# Altium schematic sheet timer_power.SchDoc
size A3; DocumentNumber: 2; SheetNumber: 2; SheetTotal: 3
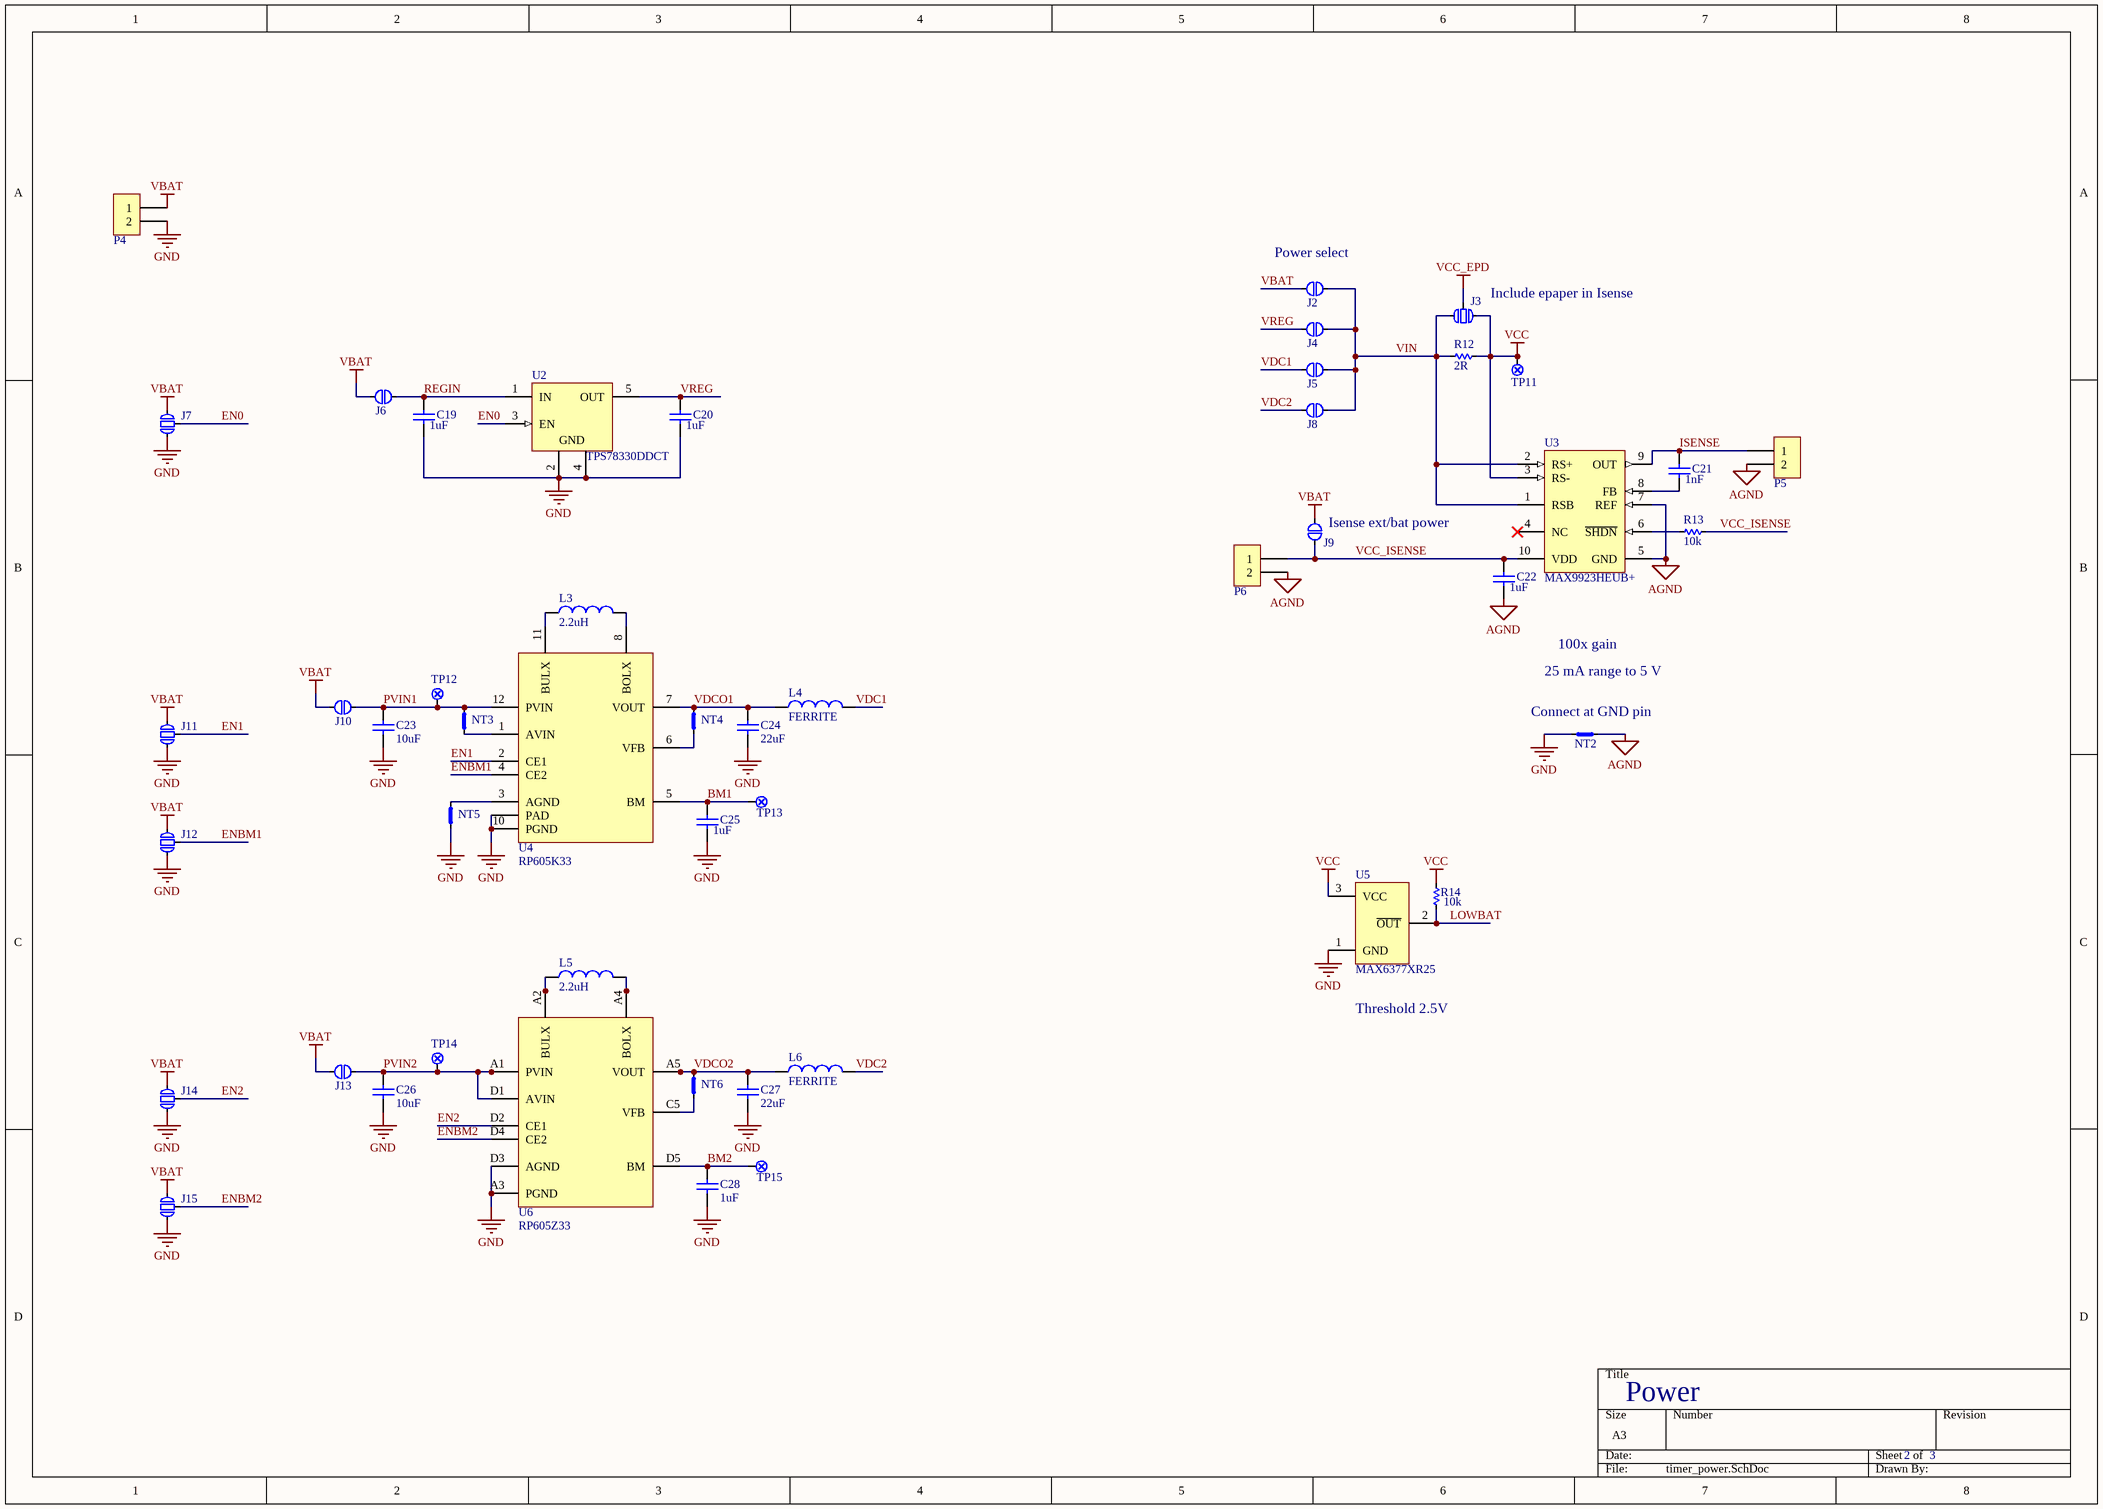
[diagram p0: timer_power.SchDoc]

## Parts
C19  value 1uF  [C0603/1608]  (hidden comment: CAP)
C20  value 1uF  [C0603/1608]  (hidden comment: CAP)
C21  value 1nF  [C0603/1608]  (hidden comment: CAP)
C22  value 1uF  [C0603/1608]  (hidden comment: CAP)
C23  value 10uF  [C0805/2012]  (hidden comment: CAP)
C24  value 22uF  [C0805/2012]  (hidden comment: CAP)
C25  value 1uF  [C0603/1608]  (hidden comment: CAP)
C26  value 10uF  [C0805/2012]  (hidden comment: CAP)
C27  value 22uF  [C0805/2012]  (hidden comment: CAP)
C28  value 1uF  [C0603/1608]  (hidden comment: CAP)
J2  SEL2  [JMP2]  (value not drawn)  (no BOM)
J3  SEL3  [JMP3]  (value not drawn)  (no BOM)
J4  SEL2  [JMP2]  (value not drawn)  (no BOM)
J5  SEL2  [JMP2]  (value not drawn)  (no BOM)
J6  SEL2  [JMP2]  (value not drawn)  (no BOM)
J7  SEL3  [JMP3]  (value not drawn)  (no BOM)
J8  SEL2  [JMP2]  (value not drawn)  (no BOM)
J9  SEL2  [JMP2]  (value not drawn)  (no BOM)
J10  SEL2  [JMP2]  (value not drawn)  (no BOM)
J11  SEL3  [JMP3]  (value not drawn)  (no BOM)
J12  SEL3  [JMP3]  (value not drawn)  (no BOM)
J13  SEL2  [JMP2]  (value not drawn)  (no BOM)
J14  SEL3  [JMP3]  (value not drawn)  (no BOM)
J15  SEL3  [JMP3]  (value not drawn)  (no BOM)
L3  value 2.2uH  [IND3x3mm]  (hidden comment: IND)
L4  value FERRITE  [R0603/1608]  (hidden comment: IND)
L5  value 2.2uH  [IND3x3mm]  (hidden comment: IND)
L6  value FERRITE  [R0603/1608]  (hidden comment: IND)
NT2  NET_TIE  [NT2_0.5mm]  (value not drawn)  (net tie, no BOM)
NT3  NET_TIE  [NT2_0.5mm]  (value not drawn)  (net tie, no BOM)
NT4  NET_TIE  [NT2_0.5mm]  (value not drawn)  (net tie, no BOM)
NT5  NET_TIE  [NT2_0.5mm]  (value not drawn)  (net tie, no BOM)
NT6  NET_TIE  [NT2_0.5mm]  (value not drawn)  (net tie, no BOM)
P4  SIL2  [PINS-2]  (value not drawn)
P5  SIL2  [PINS-2]  (value not drawn)
P6  SIL2  [PINS-2]  (value not drawn)
R12  value 2R  [R0805/2012]  (hidden comment: RES)
R13  value 10k  [R0603/1608]  (hidden comment: RES)
R14  value 10k  [R0603/1608]  (hidden comment: RES)
TP11  TP  [TP-1.0]  (value not drawn)  (no BOM)
TP12  TP  [TP-1.0]  (value not drawn)  (no BOM)
TP13  TP  [TP-1.0]  (value not drawn)  (no BOM)
TP14  TP  [TP-1.0]  (value not drawn)  (no BOM)
TP15  TP  [TP-1.0]  (value not drawn)  (no BOM)
U2  TPS78330DDCT  [DDC0005A_L]
U3  MAX9923HEUB+  [MAXM-U10+2_N]
U4  RP605K33  [DFN(PLP)2730-12]
U5  MAX6377XR25  [SC70-3]
U6  RP605Z33  [WLCSP-20-P3]

## Nets
AGND: C22.1 NT2.2 P5.2 P6.2 U3.5(GND) U3.7(REF)
GND: C19.1 C20.1 C23.1 C24.1 C25.1 C26.1 C27.1 C28.1 J7.1 J11.1 J12.1 J14.1 J15.1 NT2.1 NT5.1 P4.2 U2.2(GND) U2.4(GND) U4.0(PAD) U4.9(PGND) U4.10(PGND) U5.1(GND) U6.A3(PGND) U6.B3(PGND) U6.C3(PGND) U6.D3(AGND)
VBAT: J2.1 J6.1 J7.3 J9.2 J10.1 J11.3 J12.3 J13.1 J14.3 J15.3 P4.1
VCC: J3.1 R12.2 R14.1 TP11.0 U3.3(RS-) U5.3(VCC)
VCC_EPD: J3.2
BM1: C25.2 TP13.0 U4.5(BM)
BM2: C28.2 TP15.0 U6.D5(BM)
EN0: J7.2 U2.3(EN)
EN1: J11.2 U4.2(CE1)
EN2: J14.2 U6.D2(CE1)
ENBM1: J12.2 U4.4(CE2)
ENBM2: J15.2 U6.D4(CE2)
ISENSE: C21.2 P5.1 U3.9(OUT)
LOWBAT: R14.2 U5.2(~{OUT})
PVIN1: C23.2 J10.2 NT3.2 TP12.0 U4.12(PVIN)
PVIN2: C26.2 J13.2 TP14.0 U6.A1(PVIN) U6.B1(PVIN) U6.C1(PVIN) U6.D1(AVIN)
REGIN: C19.2 J6.2 U2.1(IN)
VCC_ISENSE: C22.2 J9.1 P6.1 R13.2 U3.10(VDD)
VDC1: J5.1 L4.2
VDC2: J8.1 L6.2
VDCO1: C24.2 L4.1 NT4.2 U4.7(VOUT)
VDCO2: C27.2 L6.1 NT6.2 U6.A5(VOUT) U6.B5(VOUT)
VIN: J2.2 J3.3 J4.2 J5.2 J8.2 R12.1 U3.1(RSB) U3.2(RS+)
VREG: C20.2 J4.1 U2.5(OUT)
NetC21_1: C21.1 U3.8(FB)
NetL3_1: L3.1 U4.11(BULX)
NetL3_2: L3.2 U4.8(BOLX)
NetL5_1: L5.1 U6.A2(BULX) U6.B2(BULX) U6.C2(BULX)
NetL5_2: L5.2 U6.A4(BOLX) U6.B4(BOLX) U6.C4(BOLX)
NetNT3_1: NT3.1 U4.1(AVIN)
NetNT4_1: NT4.1 U4.6(VFB)
NetNT5_2: NT5.2 U4.3(AGND)
NetNT6_1: NT6.1 U6.C5(VFB)
NetR13_1: R13.1 U3.6(~{SHDN})

Not connected (* = marked no-connect by the designer): U3 4(NC)*

## Notes on the sheet
- (near J2) Power select
- (near J3) Include epaper in Isense
- (near J9) Isense ext/bat power
- 100x gain
- (near NT2) Connect at GND pin
- 25 mA range to 5 V
- (near U5) Threshold 2.5V
- Power

## Library data of the parts
C19-C28 = CAP: Capacitor; Tolerance: x%; Voltage: 6.3V; Type: X5R/X7R
J2 J4-J6 J8-J10 J13 = SEL2: solderable jumper
J3 J7 J11 J12 J14 J15 = SEL3: solderable jumper
L3-L6 = IND: Inductor
NT2-NT6 = NET_TIE2: Link between nets
P4-P6 = SIL2: SIL package, 2 pins
R12-R14 = RES: Resistor; Tolerance: x%
TP11-TP15 = TP: Test point
U2 = CMP-0394-01077-2: Single Output LDO, 150 mA, Fixed 3 V Output, 2.2 to 5.5 V Input, with Ultra-Low IQ, 5-pin SOT (DDC), -40 to 105 degC, Green (RoHS & no Sb/Br); Manufacturer: Texas Instruments; Vout Adj(Min)(V): 3; SubFamily: Single Channel LDO; Iout(Max)(A): 0.15; Vdo(Typ)(mV): 130; Rating: Catalog; Iq(Typ)(mA): 0.0005; Vin(Min)(V): 2.2; Vin(Max)(V): 5.5; PackageDescription: 5-Pin Plastic Small Outline, Body 2.9 x 1.6 mm, 0.95 mm Pitch; ComponentLink1Description: Manufacturer URL; Code_JEDEC: MO-193; PackageVersion: 4204403-2/E; ComponentLink1URL: http://www.ti.com/; Mounting Technology: Surface Mount; ComponentLink3URL: http://www.ti.com/litv/pdf/mpds123d; ComponentLink2Description: Datasheet; ComponentLink2URL: http://www.ti.com/general/docs/lit/getliterature.tsp?genericPartNumber=TPS78330&fileType=pdf; DatasheetVersion: SBVS133; Accuracy(%): 3; ComponentLink3Description: Package Specification; Vout Adj(Max)(V): 3; PartNumber: TPS78330DDCT; PackageReference: DDC0005A; Fixed Output Options(V): 3; Eco-Plan: Green (RoHS & no Sb/Br)
U3 = CMP-0252-00274-1: Ultra-Precision, High-Side Current-Sense Amplifier with Fixed Gain, 100 V / V Gain, -40 to 85 degC, 10-Pin SOP (U10+2), Pb-Free; Bi-Dir. Curr. Sense: Yes; Gain: 25 V/V, 100 V/V ,250 V/V; PartNumber: MAX9923HEUB+; Code_JEDEC: MO-187; ComponentLink3URL: http://pdfserv.maximintegrated.com/package_dwgs/21-0061.PDF; ComponentLink2URL: http://datasheets.maximintegrated.com/en/ds/MAX9922-MAX9923.pdf; PackageDescription: 10-Pin Micro-MAX, Thin Shrink Small-Outline (U10+2), Body 3 x 3 mm, Pitch 0.5 mm; ComponentLink2Description: Datasheet; PackageReference: U10+2; ComponentLink3Description: Package Specification; Mounting Technology: Surface Mount; ComponentLink1Description: Manufacturer URL; PackageVersion: Rev. L, 07/2008; ComponentLink1URL: http://www.maximintegrated.com/; DatasheetVersion: Rev. 1
U4 = RP605xK: 300mA Ultra-low Power Buck Boost DC/DC Converter with Battery Monitor, DFN-12 package
U5 = MAX637x: Ultra-Low-Power Voltage Detector
U6 = RP605xZ: 300mA Ultra-low Power Buck Boost DC/DC Converter with Battery Monitor, WLCSP-20 package